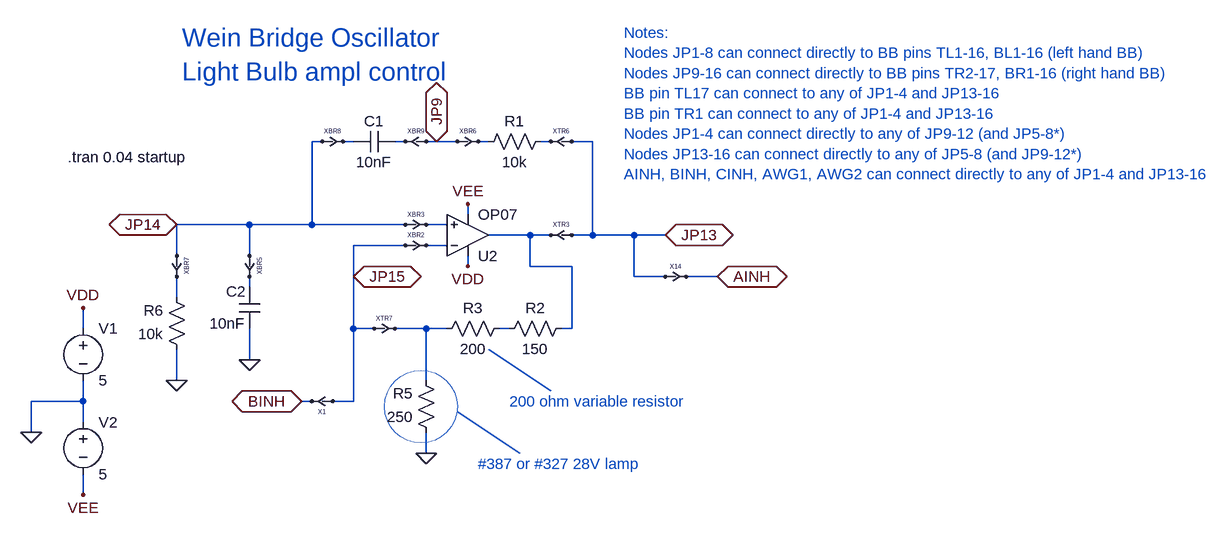
[diagram p0: schematic wien_bridge_osc_light-bulb.asc]
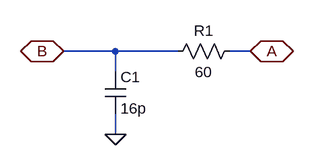
[diagram p1: sub-circuit cross_point.asc]
wien_bridge_osc_light-bulb.asc, the LTspice schematic file:
Version 4
SHEET 1 1728 792
WIRE 32 96 16 96
WIRE 80 96 64 96
WIRE 160 96 144 96
WIRE 208 96 192 96
WIRE 240 96 208 96
WIRE 288 96 272 96
WIRE 384 96 368 96
WIRE 448 96 416 96
WIRE 256 208 256 192
WIRE -80 224 -192 224
WIRE 16 224 16 96
WIRE 16 224 -80 224
WIRE 160 224 16 224
WIRE 224 224 192 224
WIRE 352 240 288 240
WIRE 384 240 352 240
WIRE 448 240 448 96
WIRE 448 240 416 240
WIRE 512 240 448 240
WIRE 560 240 512 240
WIRE 160 256 80 256
WIRE 224 256 192 256
WIRE -192 272 -192 224
WIRE -80 272 -80 224
WIRE 256 288 256 272
WIRE 352 288 352 240
WIRE 416 288 352 288
WIRE 80 304 80 256
WIRE 512 304 512 240
WIRE 560 304 512 304
WIRE 640 304 592 304
WIRE -80 320 -80 304
WIRE -192 336 -192 304
WIRE -336 384 -336 352
WIRE 80 384 80 304
WIRE 112 384 80 384
WIRE 192 384 144 384
WIRE 224 384 192 384
WIRE 320 384 304 384
WIRE 416 384 416 288
WIRE 416 384 400 384
WIRE -80 432 -80 384
WIRE -192 464 -192 416
WIRE 192 464 192 384
WIRE -336 496 -336 464
WIRE -336 496 -416 496
WIRE 16 496 0 496
WIRE 80 496 80 384
WIRE 80 496 48 496
WIRE -336 528 -336 496
WIRE -416 544 -416 496
WIRE 192 576 192 544
WIRE -336 640 -336 608
FLAG -416 544 0
FLAG -336 352 VDD
FLAG 256 288 VDD
FLAG -336 640 VEE
FLAG 256 192 VEE
FLAG -80 432 0
FLAG -192 464 0
FLAG 192 576 0
FLAG 560 240 JP13
IOPIN 560 240 BiDir
FLAG 208 96 JP9
IOPIN 208 96 BiDir
FLAG 80 304 JP15
IOPIN 80 304 BiDir
FLAG -192 224 JP14
IOPIN -192 224 BiDir
FLAG 640 304 AINH
IOPIN 640 304 BiDir
FLAG 0 496 BINH
IOPIN 0 496 BiDir
SYMBOL voltage -336 368 R0
WINDOW 123 0 0 Left 0
WINDOW 39 0 0 Left 0
SYMATTR InstName V1
SYMATTR Value 5
SYMBOL voltage -336 512 R0
WINDOW 123 0 0 Left 0
WINDOW 39 0 0 Left 0
SYMATTR InstName V2
SYMATTR Value 5
SYMBOL res 384 80 R90
WINDOW 0 0 56 VBottom 2
WINDOW 3 32 56 VTop 2
SYMATTR InstName R1
SYMATTR Value 10k
SYMBOL res 416 368 R90
WINDOW 0 0 56 VBottom 2
WINDOW 3 32 56 VTop 2
SYMATTR InstName R2
SYMATTR Value 150
SYMBOL res 320 368 R90
WINDOW 0 0 56 VBottom 2
WINDOW 3 32 56 VTop 2
SYMATTR InstName R3
SYMATTR Value 200
SYMBOL res 208 560 R180
WINDOW 0 36 76 Left 2
WINDOW 3 36 40 Left 2
SYMATTR InstName R5
SYMATTR Value 250
SYMBOL cap 144 80 R90
WINDOW 0 0 32 VBottom 2
WINDOW 3 32 32 VTop 2
SYMATTR InstName C1
SYMATTR Value 10nF
SYMBOL cap -96 384 M180
WINDOW 0 -20 57 Left 2
WINDOW 3 -45 8 Left 2
SYMATTR InstName C2
SYMATTR Value 10nF
SYMBOL res -176 432 R180
WINDOW 0 36 76 Left 2
WINDOW 3 36 40 Left 2
SYMATTR InstName R6
SYMATTR Value 10k
SYMBOL cross_point 400 240 R0
SYMATTR InstName XTR3
SYMBOL cross_point 176 224 M0
SYMATTR InstName XBR3
SYMBOL cross_point 176 256 M0
SYMATTR InstName XBR2
SYMBOL cross_point 128 384 M0
SYMATTR InstName XTR7
SYMBOL cross_point 48 96 M0
SYMATTR InstName XBR8
SYMBOL cross_point 576 304 M0
SYMATTR InstName X14
SYMBOL OpAmps\\OP07 256 304 M180
SYMATTR InstName U2
SYMBOL cross_point 32 496 M180
SYMATTR InstName X1
SYMBOL cross_point -192 288 M270
SYMATTR InstName XBR7
SYMBOL cross_point -80 288 M270
SYMATTR InstName XBR5
SYMBOL cross_point 176 96 R0
SYMATTR InstName XBR9
SYMBOL cross_point 256 96 M0
SYMATTR InstName XBR6
SYMBOL cross_point 400 96 R0
SYMATTR InstName XTR6
TEXT -360 120 Left 2 !.tran 0.04 startup
TEXT -184 -64 Left 4 ;Wein Bridge Oscillator\nLight Bulb ampl control
TEXT 496 -72 Left 2 ;Notes:\nNodes JP1-8 can connect directly to BB pins TL1-16, BL1-16 (left hand BB)\nNodes JP9-16 can connect directly to BB pins TR2-17, BR1-16 (right hand BB)\nBB pin TL17 can connect to any of JP1-4 and JP13-16\nBB pin TR1 can connect to any of JP1-4 and JP13-16\nNodes JP1-4 can connect directly to any of JP9-12 (and JP5-8*)\nNodes JP13-16 can connect directly to any of JP5-8 (and JP9-12*)\nAINH, BINH, CINH, AWG1, AWG2 can connect directly to any of JP1-4 and JP13-16
TEXT 272 592 Left 2 ;#387 or #327 28V lamp
TEXT 320 496 Left 2 ;200 ohm variable resistor
LINE Normal 336 576 240 512
LINE Normal 384 480 288 416
CIRCLE Normal 240 448 128 560 2

cross_point.asc, the sub-circuit schematic file:
Version 4
SHEET 1 880 680
WIRE 80 160 0 160
WIRE 176 160 80 160
WIRE 288 160 256 160
WIRE 80 192 80 160
WIRE 80 288 80 256
FLAG 288 160 A
IOPIN 288 160 BiDir
FLAG 0 160 B
IOPIN 0 160 BiDir
FLAG 80 288 0
SYMBOL res 272 144 R90
WINDOW 0 0 56 VBottom 2
WINDOW 3 32 56 VTop 2
SYMATTR InstName R1
SYMATTR Value 60
SYMBOL cap 64 192 R0
SYMATTR InstName C1
SYMATTR Value 16p

The netlist it stands for:
* wien_bridge_osc_light-bulb.asc
V1 VDD 0 5
V2 0 VEE 5
R1 N004 N003 10k
R2 N006 N011 150
R3 N011 N010 200
R5 0 N010 250
C1 N002 N001 10nF
C2 0 N008 10nF
R6 0 N009 10k
XXTR3 JP13 N006 cross_point
XXBR3 JP14 N005 cross_point
XXBR2 JP15 N007 cross_point
XXTR7 JP15 N010 cross_point
XXBR8 JP14 N001 cross_point
XX14 JP13 AINH cross_point
XU2 N005 N007 VDD VEE N006 LT1001  ; OP07, pins In+ In- V+ V- OUT
XX1 JP15 BINH cross_point
XXBR7 JP14 N009 cross_point
XXBR5 JP14 N008 cross_point
XXBR9 JP9 N002 cross_point
XXBR6 JP9 N003 cross_point
XXTR6 JP13 N004 cross_point

* block symbol definitions
.subckt cross_point A B
R1 A B 60
C1 B 0 16p
.ends cross_point

.tran 0.04 startup
* Wein Bridge Oscillator
* Light Bulb ampl control
* Notes:
* Nodes JP1-8 can connect directly to BB pins TL1-16, BL1-16 (left hand BB)
* Nodes JP9-16 can connect directly to BB pins TR2-17, BR1-16 (right hand BB)
* BB pin TL17 can connect to any of JP1-4 and JP13-16
* BB pin TR1 can connect to any of JP1-4 and JP13-16
* Nodes JP1-4 can connect directly to any of JP9-12 (and JP5-8*)
* Nodes JP13-16 can connect directly to any of JP5-8 (and JP9-12*)
* AINH, BINH, CINH, AWG1, AWG2 can connect directly to any of JP1-4 and JP13-16
* #387 or #327 28V lamp
* 200 ohm variable resistor
.lib LTC.lib
.backanno
.end